# Altium project AS608+LCD.PrjPcb
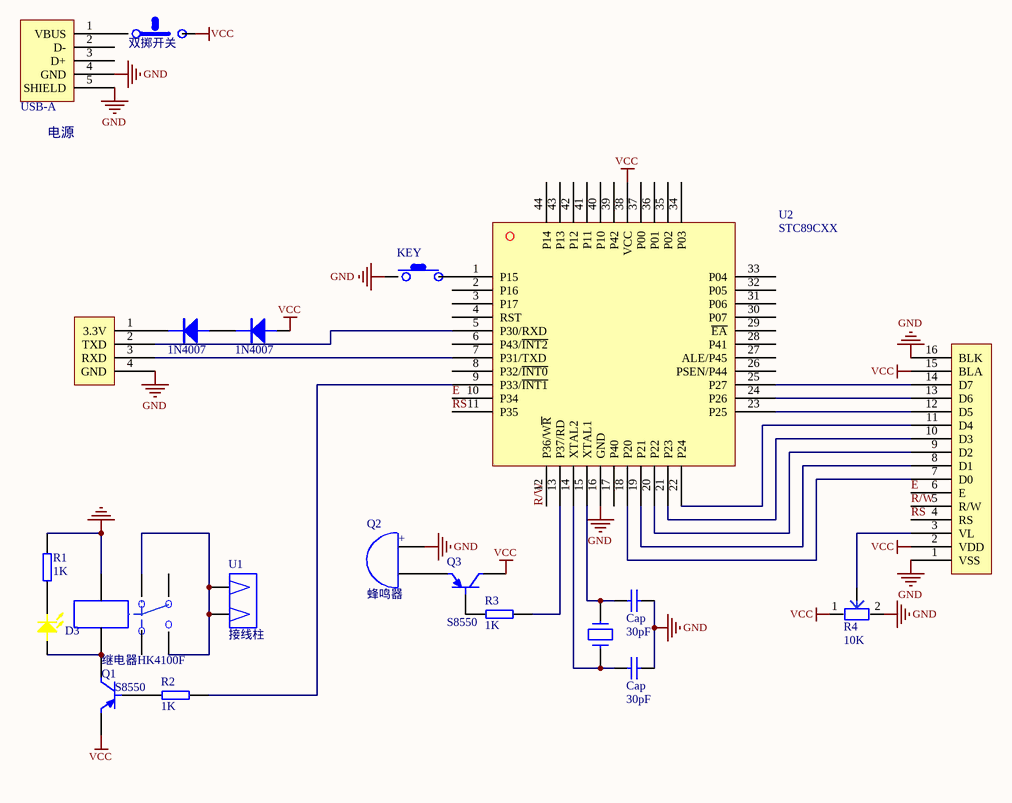
[diagram p0: AS608+LCD.SchDoc]
1 sheet, 21 parts. Net scope: global (net labels, ports and power ports of the same name join across sheets).
Board file: PCB1.PcbDoc

## Sheet AS608+LCD.SchDoc
size A4

### Parts
(Parts that share a designator on the sheet are numbered #1, #2 ... from top to bottom, then left to right.)
#1  继电器HK4100F  [HK4100F]
#2  12MHZ  [XTAL]  (value not drawn)
C?#1  Cap  value 30pF  [0805C]
C?#2  Cap  value 30pF  [0805C]
D1  1N4007  [SMA(DO-214AC)_S3]
D2  1N4007  [SMA(DO-214AC)_S3]
D3  LED-YELLOW  [0805D]  (value not drawn)
KEY  功能按键  [SW5*5]  (value not drawn)
Q1  S8550  [三极管]
Q2  蜂鸣器  [蜂鸣器]
Q3  S8550  [三极管]
Q4  LCD1602  [HDR16]  (value not drawn)
R1  1K  [0805R]
R2  1K  [0805R]
R3  1K  [0805R]
R4  10K  [Res-JT]
SW?  双掷开关  [SS12D07G5]
U1  接线柱  [XH2P]
U2  STC89CXX  [LQFP44]
U3  USB-A  [USB-A贴片]
U?  s  [XH4P]  (value not drawn)

### Nets
GND: #1.5 C?#1.2 C?#2.2 KEY.1 Q2.1 Q4.1(VSS) Q4.16(BLK) R1.1 R4.2 U2.16(GND) U3.4(GND) U3.5(SHIELD) U?.4(GND)
VCC: D2.1 Q1.1(E) Q3.3(C) Q4.2(VDD) Q4.15(BLA) R4.1 SW?.2 U2.38(VCC)
E: Q4.6(E) U2.10(P34)
R/W: Q4.5(R/W) U2.12(P36/W~{R})
RS: Q4.4(RS) U2.11(P35)
Net#1_2: #1.2 D3.1 Q1.3(C)
Net#1_4: #1.4 #1.6 U1.1 U1.2
Net#2_1: #2.1 C?#2.1 U2.14(XTAL2)
Net#2_2: #2.2 C?#1.1 U2.15(XTAL1)
NetD1_1: D1.1 D2.2
NetD1_2: D1.2 U?.1(3.3V)
NetD3_2: D3.2 R1.2
NetKEY_2: KEY.2 U2.1(P15)
NetQ1_2: Q1.2(B) R2.1
NetQ2_2: Q2.2 Q3.1(E)
NetQ3_2: Q3.2(B) R3.1
NetQ4_3: Q4.3(VL) R4.3
NetQ4_7: Q4.7(D0) U2.18(P20)
NetQ4_8: Q4.8(D1) U2.19(P21)
NetQ4_9: Q4.9(D2) U2.20(P22)
NetQ4_10: Q4.10(D3) U2.21(P23)
NetQ4_11: Q4.11(D4) U2.22(P24)
NetQ4_12: Q4.12(D5) U2.23(P25)
NetQ4_13: Q4.13(D6) U2.24(P26)
NetQ4_14: Q4.14(D7) U2.25(P27)
NetR2_2: R2.2 U2.9(P33/~{INT1})
NetR3_2: R3.2 U2.13(P37/RD)
NetSW?_1: SW?.1 U3.1(VBUS)
NetU2_5: U2.5(P30/RXD) U?.2(TXD)
NetU2_7: U2.7(P31/TXD) U?.3(RXD)

Not connected (* = marked no-connect by the designer): #1 1 3; U2 2(P16) 3(P17) 4(RST) 6(P43/~{INT2}) 8(P32/~{INT0}) 17(P40) 26(PSEN/P44) 27(ALE/P45) 28(P41) 29(~{EA}) 30(P07) 31(P06) 32(P05) 33(P04) 34(P03) 35(P02) 36(P01) 37(P00) 39(P42) 40(P10) 41(P11) 42(P12) 43(P13) 44(P14); U3 2(D-) 3(D+)

### Notes on the sheet
- (near U3) 电源
- (in symbol 蜂鸣器) +

### Library data of the parts
#2 = XTAL
C?#1 C?#2 = Cap: Capacitor; Published: 8-Jun-2000; LatestRevisionDate: 17-Jul-2002; LatestRevisionNote: Re-released for DXP Platform.; PackageReference: RAD-0.3; Publisher: Altium Limited; PackageDescription: Radial Cap, Thru-Hole; 2 Leads; 0.3 in Pin Spacing
KEY = 微动开关
R1-R3 = RES
R4 = 电位器
U? = AS608